# Altium schematic sheet control.SchDoc
size A3
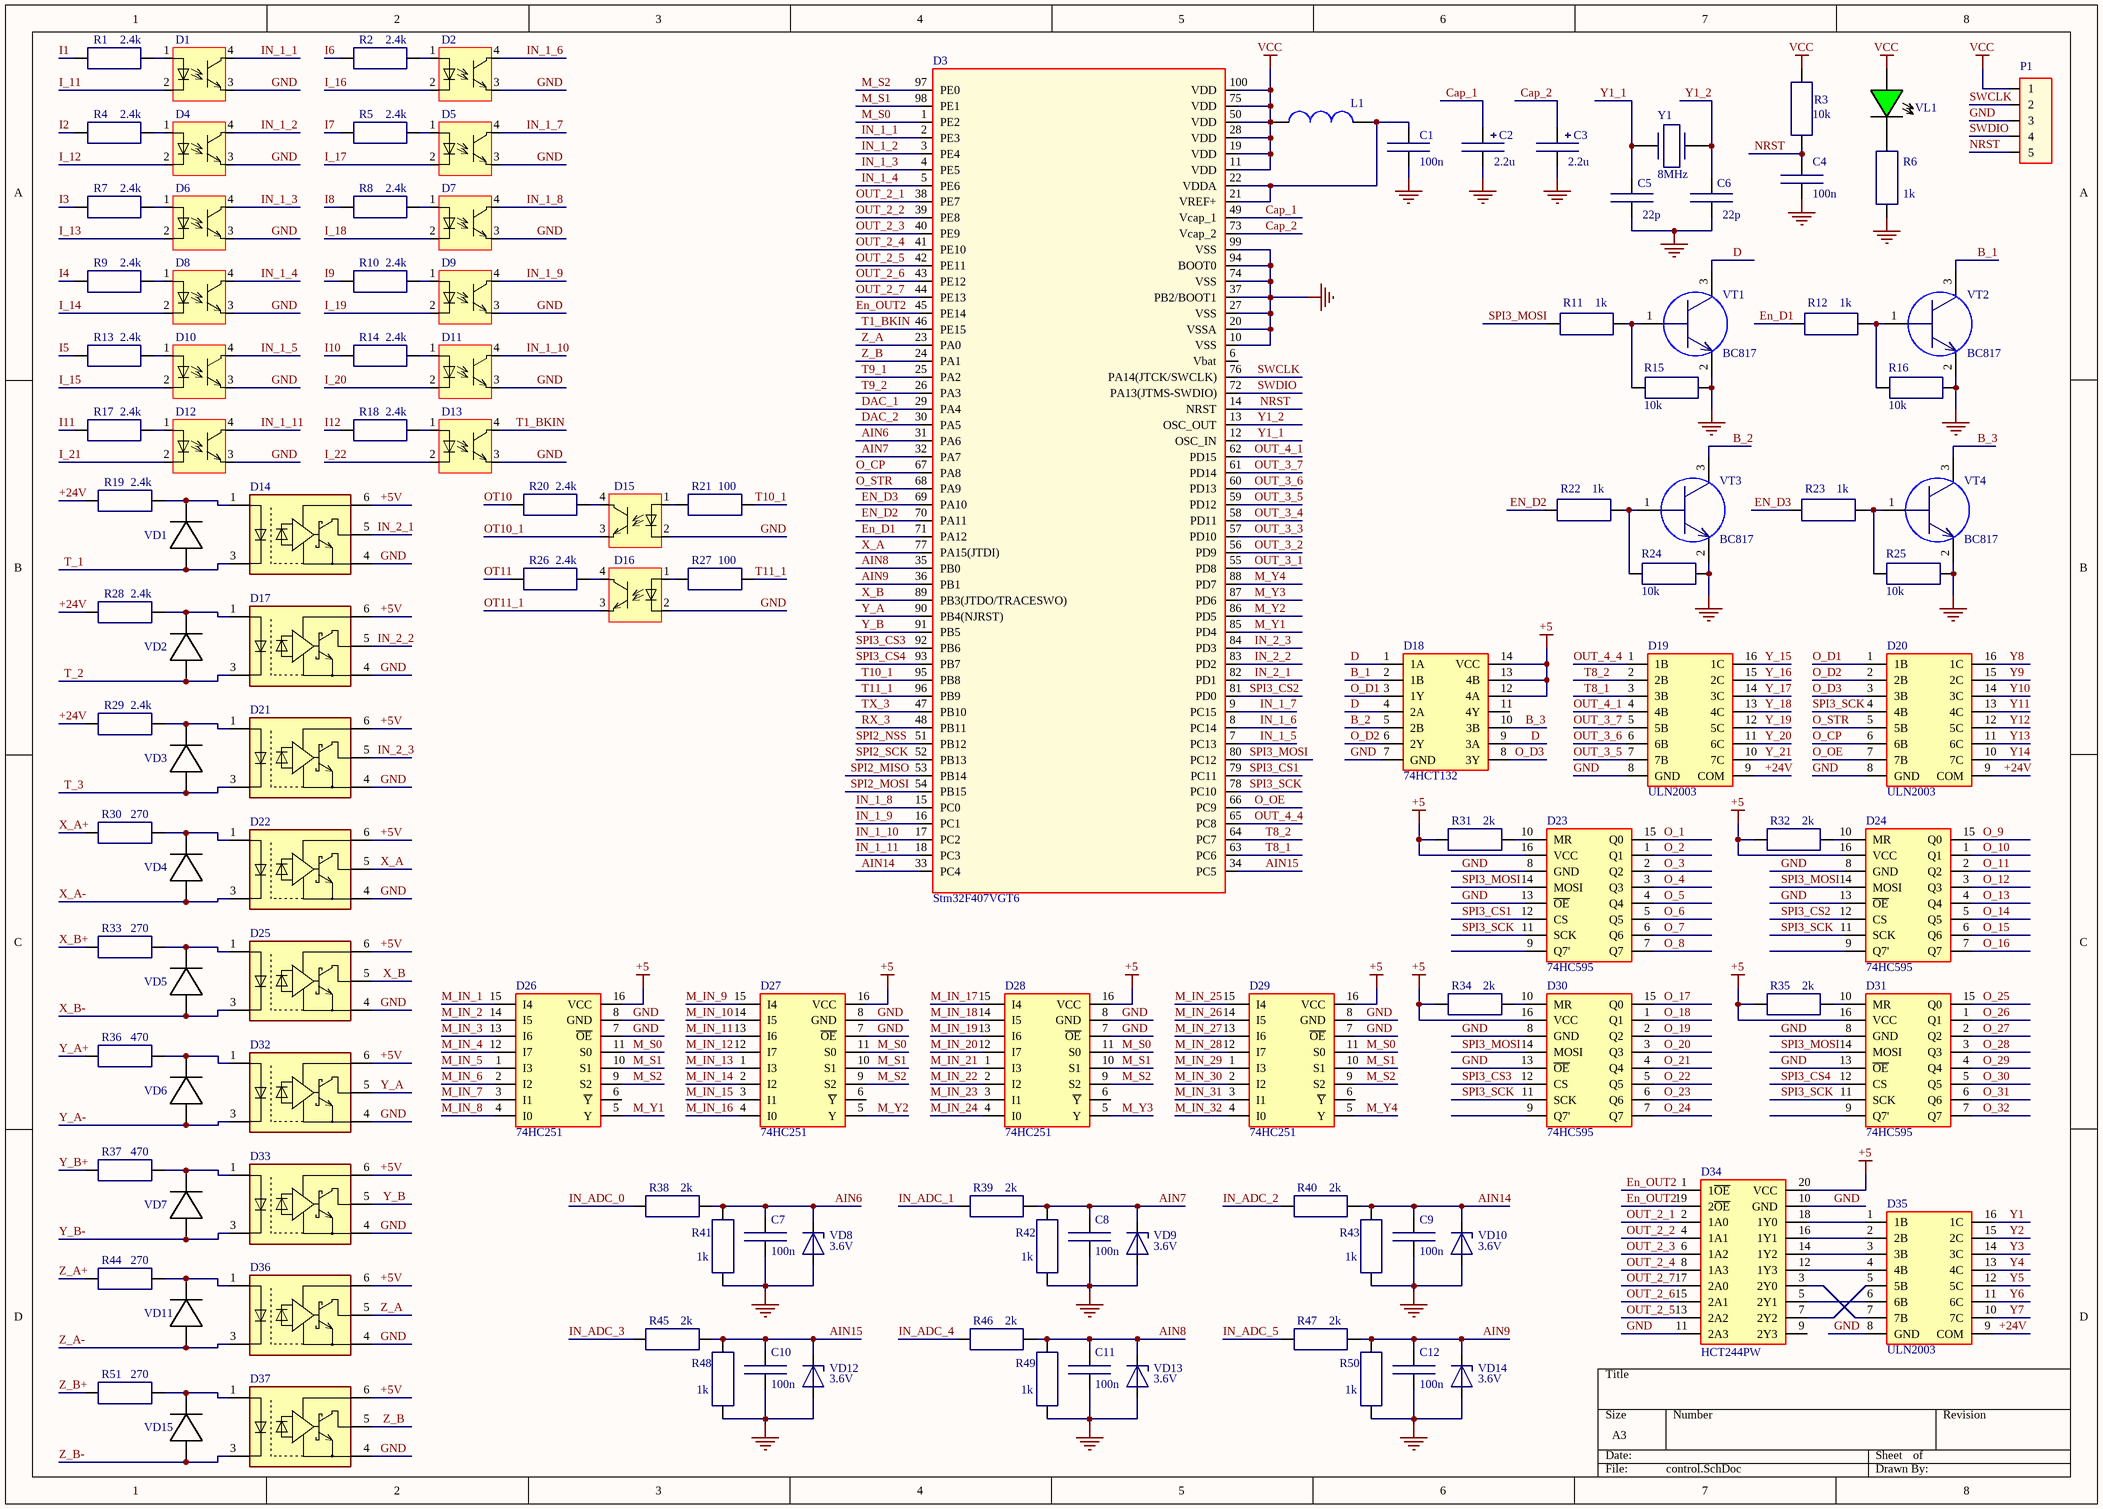
[diagram p0: control.SchDoc]

## Parts
C1  100n  [C0805]
C2  2.2u  [R1206]
C3  2.2u  [R1206]
C4  100n  [C0805]
C5  22p  [C0805]
C6  22p  [C0805]
C7  100n  [C0805]
C8  100n  [C0805]
C9  100n  [C0805]
C10  100n  [C0805]
C11  100n  [C0805]
C12  100n  [C0805]
D1  hcpl-181  [SOP4]  (value not drawn)
D2  hcpl-181  [SOP4]  (value not drawn)
D3  Stm32F407VGT6  [LQFP100]
D4  hcpl-181  [SOP4]  (value not drawn)
D5  hcpl-181  [SOP4]  (value not drawn)
D6  hcpl-181  [SOP4]  (value not drawn)
D7  hcpl-181  [SOP4]  (value not drawn)
D8  hcpl-181  [SOP4]  (value not drawn)
D9  hcpl-181  [SOP4]  (value not drawn)
D10  hcpl-181  [SOP4]  (value not drawn)
D11  hcpl-181  [SOP4]  (value not drawn)
D12  hcpl-181  [SOP4]  (value not drawn)
D13  hcpl-181  [SOP4]  (value not drawn)
D14  LTV-601  [SOP5]  (value not drawn)
D15  hcpl-181  [SOP4]  (value not drawn)
D16  hcpl-181  [SOP4]  (value not drawn)
D17  LTV-601  [SOP5]  (value not drawn)
D18  74HCT132  [SO-14]
D19  ULN2003  [SOIC-16]
D20  ULN2003  [SOIC-16]
D21  LTV-601  [SOP5]  (value not drawn)
D22  LTV-601  [SOP5]  (value not drawn)
D23  74HC595  [SOP16_595]
D24  74HC595  [SOP16_595]
D25  LTV-601  [SOP5]  (value not drawn)
D26  74HC251  [SOP16_595]
D27  74HC251  [SOP16_595]
D28  74HC251  [SOP16_595]
D29  74HC251  [SOP16_595]
D30  74HC595  [SOP16_595]
D31  74HC595  [SOP16_595]
D32  LTV-601  [SOP5]  (value not drawn)
D33  LTV-601  [SOP5]  (value not drawn)
D34  HCT244PW  [TSSOP20]
D35  ULN2003  [SOIC-16]
D36  LTV-601  [SOP5]  (value not drawn)
D37  LTV-601  [SOP5]  (value not drawn)
L1  L  [L]  (value not drawn)
P1  Con_5  [Con_5]  (value not drawn)
R1  2.4k  [R1206]
R2  2.4k  [R1206]
R3  10k  [R0805]
R4  2.4k  [R1206]
R5  2.4k  [R1206]
R6  1k  [R0805]
R7  2.4k  [R1206]
R8  2.4k  [R1206]
R9  2.4k  [R1206]
R10  2.4k  [R1206]
R11  1k  [R0805]
R12  1k  [R0805]
R13  2.4k  [R1206]
R14  2.4k  [R1206]
R15  10k  [R0805]
R16  10k  [R0805]
R17  2.4k  [R1206]
R18  2.4k  [R1206]
R19  2.4k  [R1206]
R20  2.4k  [R1206]
R21  100  [R0805]
R22  1k  [R0805]
R23  1k  [R0805]
R24  10k  [R0805]
R25  10k  [R0805]
R26  2.4k  [R1206]
R27  100  [R0805]
R28  2.4k  [R1206]
R29  2.4k  [R1206]
R30  270  [R0805]
R31  2k  [R0805]
R32  2k  [R0805]
R33  270  [R0805]
R34  2k  [R0805]
R35  2k  [R0805]
R36  470  [R0805]
R37  470  [R0805]
R38  2k  [R0805]
R39  2k  [R0805]
R40  2k  [R0805]
R41  1k  [R0805]
R42  1k  [R0805]
R43  1k  [R0805]
R44  270  [R0805]
R45  2k  [R0805]
R46  2k  [R0805]
R47  2k  [R0805]
R48  1k  [R0805]
R49  1k  [R0805]
R50  1k  [R0805]
R51  270  [R0805]
VD1  LL4448  [R1206]  (value not drawn)
VD2  LL4448  [R1206]  (value not drawn)
VD3  LL4448  [R1206]  (value not drawn)
VD4  LL4448  [R1206]  (value not drawn)
VD5  LL4448  [R1206]  (value not drawn)
VD6  LL4448  [R1206]  (value not drawn)
VD7  LL4448  [R1206]  (value not drawn)
VD8  3.6V  [R1206]
VD9  3.6V  [R1206]
VD10  3.6V  [R1206]
VD11  LL4448  [R1206]  (value not drawn)
VD12  3.6V  [R1206]
VD13  3.6V  [R1206]
VD14  3.6V  [R1206]
VD15  LL4448  [R1206]  (value not drawn)
VL1  LED_1206  [R1206]  (value not drawn)
VT1  BC817  [SOT-23]
VT2  BC817  [SOT-23]
VT3  BC817  [SOT-23]
VT4  BC817  [SOT-23]
Y1  8MHz  [Crystal]

## Nets
+5: D18.12(4A) D18.13(4B) D18.14(VCC) D23.16(VCC) D24.16(VCC) D26.16(VCC) D27.16(VCC) D28.16(VCC) D29.16(VCC) D30.16(VCC) D31.16(VCC) D34.20(VCC) R31.2 R32.2 R34.2 R35.2
GND: C1.2 C2.2 C3.2 C4.1 C5.2 C6.2 C7.2 C8.2 C9.2 C10.2 C11.2 C12.2 D1.3 D2.3 D3.10(VSS) D3.20(VSSA) D3.27(VSS) D3.37(PB2/BOOT1) D3.74(VSS) D3.94(BOOT0) D3.99(VSS) D4.3 D5.3 D6.3 D7.3 D8.3 D9.3 D10.3 D11.3 D12.3 D13.3 D14.4 D15.2 D16.2 D17.4 D18.7(GND) D19.8(GND) D20.8(GND) D21.4 D22.4 D23.8(GND) D23.13(~{OE}) D24.8(GND) D24.13(~{OE}) D25.4 D26.7(~{OE}) D26.8(GND) D27.7(~{OE}) D27.8(GND) D28.7(~{OE}) D28.8(GND) D29.7(~{OE}) D29.8(GND) D30.8(GND) D30.13(~{OE}) D31.8(GND) D31.13(~{OE}) D32.4 D33.4 D34.10(GND) D34.11(2A3) D35.8(GND) D36.4 D37.4 P1.3 R6.1 R15.1 R16.1 R24.1 R25.1 R41.1 R42.1 R43.1 R48.1 R49.1 R50.1 VD8.1 VD9.1 VD10.1 VD12.1 VD13.1 VD14.1 VT1.2 VT2.2 VT3.2 VT4.2
VCC: D3.11(VDD) D3.19(VDD) D3.28(VDD) D3.50(VDD) D3.75(VDD) D3.100(VDD) L1.1 P1.1 R3.1 VL1.1
+5V: D14.6 D17.6 D21.6 D22.6 D25.6 D32.6 D33.6 D36.6 D37.6
+24V: D19.9(COM) D20.9(COM) D35.9(COM) R19.1 R28.1 R29.1
AIN6: C7.1 D3.31(PA6) R38.2 R41.2 VD8.2
AIN7: C8.1 D3.32(PA7) R39.2 R42.2 VD9.2
AIN8: C11.1 D3.35(PB0) R46.2 R49.2 VD13.2
AIN9: C12.1 D3.36(PB1) R47.2 R50.2 VD14.2
AIN14: C9.1 D3.33(PC4) R40.2 R43.2 VD10.2
AIN15: C10.1 D3.34(PC5) R45.2 R48.2 VD12.2
B_1: D18.2(1B) VT2.3
B_2: D18.5(2B) VT3.3
B_3: D18.10(3B) VT4.3
Cap_1: C2.1 D3.49(Vcap_1)
Cap_2: C3.1 D3.73(Vcap_2)
D: D18.1(1A) D18.4(2A) D18.9(3A) VT1.3
DAC_1: D3.29(PA4)
DAC_2: D3.30(PA5)
En_D1: D3.71(PA12) R12.1
EN_D2: D3.70(PA11) R22.1
EN_D3: D3.69(PA10) R23.1
En_OUT2: D3.45(PE14) D34.1(1~{OE}) D34.19(2~{OE})
I1: R1.1
I2: R4.1
I3: R7.1
I4: R9.1
I5: R13.1
I6: R2.1
I7: R5.1
I8: R8.1
I9: R10.1
I10: R14.1
I11: R17.1
I12: R18.1
I_11: D1.2
I_12: D4.2
I_13: D6.2
I_14: D8.2
I_15: D10.2
I_16: D2.2
I_17: D5.2
I_18: D7.2
I_19: D9.2
I_20: D11.2
I_21: D12.2
I_22: D13.2
IN_1_1: D1.4 D3.2(PE3)
IN_1_2: D3.3(PE4) D4.4
IN_1_3: D3.4(PE5) D6.4
IN_1_4: D3.5(PE6) D8.4
IN_1_5: D3.7(PC13) D10.4
IN_1_6: D2.4 D3.8(PC14)
IN_1_7: D3.9(PC15) D5.4
IN_1_8: D3.15(PC0) D7.4
IN_1_9: D3.16(PC1) D9.4
IN_1_10: D3.17(PC2) D11.4
IN_1_11: D3.18(PC3) D12.4
IN_2_1: D3.82(PD1) D14.5
IN_2_2: D3.83(PD2) D17.5
IN_2_3: D3.84(PD3) D21.5
IN_ADC_0: R38.1
IN_ADC_1: R39.1
IN_ADC_2: R40.1
IN_ADC_3: R45.1
IN_ADC_4: R46.1
IN_ADC_5: R47.1
M_IN_1: D26.15(I4)
M_IN_2: D26.14(I5)
M_IN_3: D26.13(I6)
M_IN_4: D26.12(I7)
M_IN_5: D26.1(I3)
M_IN_6: D26.2(I2)
M_IN_7: D26.3(I1)
M_IN_8: D26.4(I0)
M_IN_9: D27.15(I4)
M_IN_10: D27.14(I5)
M_IN_11: D27.13(I6)
M_IN_12: D27.12(I7)
M_IN_13: D27.1(I3)
M_IN_14: D27.2(I2)
M_IN_15: D27.3(I1)
M_IN_16: D27.4(I0)
M_IN_17: D28.15(I4)
M_IN_18: D28.14(I5)
M_IN_19: D28.13(I6)
M_IN_20: D28.12(I7)
M_IN_21: D28.1(I3)
M_IN_22: D28.2(I2)
M_IN_23: D28.3(I1)
M_IN_24: D28.4(I0)
M_IN_25: D29.15(I4)
M_IN_26: D29.14(I5)
M_IN_27: D29.13(I6)
M_IN_28: D29.12(I7)
M_IN_29: D29.1(I3)
M_IN_30: D29.2(I2)
M_IN_31: D29.3(I1)
M_IN_32: D29.4(I0)
M_S0: D3.1(PE2) D26.11(S0) D27.11(S0) D28.11(S0) D29.11(S0)
M_S1: D3.98(PE1) D26.10(S1) D27.10(S1) D28.10(S1) D29.10(S1)
M_S2: D3.97(PE0) D26.9(S2) D27.9(S2) D28.9(S2) D29.9(S2)
M_Y1: D3.85(PD4) D26.5(Y)
M_Y2: D3.86(PD5) D27.5(Y)
M_Y3: D3.87(PD6) D28.5(Y)
M_Y4: D3.88(PD7) D29.5(Y)
NRST: C4.2 D3.14(NRST) P1.5 R3.2
O_1: D23.15(Q0)
O_2: D23.1(Q1)
O_3: D23.2(Q2)
O_4: D23.3(Q3)
O_5: D23.4(Q4)
O_6: D23.5(Q5)
O_7: D23.6(Q6)
O_8: D23.7(Q7)
O_9: D24.15(Q0)
O_10: D24.1(Q1)
O_11: D24.2(Q2)
O_12: D24.3(Q3)
O_13: D24.4(Q4)
O_14: D24.5(Q5)
O_15: D24.6(Q6)
O_16: D24.7(Q7)
O_17: D30.15(Q0)
O_18: D30.1(Q1)
O_19: D30.2(Q2)
O_20: D30.3(Q3)
O_21: D30.4(Q4)
O_22: D30.5(Q5)
O_23: D30.6(Q6)
O_24: D30.7(Q7)
O_25: D31.15(Q0)
O_26: D31.1(Q1)
O_27: D31.2(Q2)
O_28: D31.3(Q3)
O_29: D31.4(Q4)
O_30: D31.5(Q5)
O_31: D31.6(Q6)
O_32: D31.7(Q7)
O_CP: D3.67(PA8) D20.6(6B)
O_D1: D18.3(1Y) D20.1(1B)
O_D2: D18.6(2Y) D20.2(2B)
O_D3: D18.8(3Y) D20.3(3B)
O_OE: D3.66(PC9) D20.7(7B)
O_STR: D3.68(PA9) D20.5(5B)
OT10: R20.1
OT10_1: D15.3
OT11: R26.1
OT11_1: D16.3
OUT_2_1: D3.38(PE7) D34.2(1A0)
OUT_2_2: D3.39(PE8) D34.4(1A1)
OUT_2_3: D3.40(PE9) D34.6(1A2)
OUT_2_4: D3.41(PE10) D34.8(1A3)
OUT_2_5: D3.42(PE11) D34.13(2A2)
OUT_2_6: D3.43(PE12) D34.15(2A1)
OUT_2_7: D3.44(PE13) D34.17(2A0)
OUT_3_1: D3.55(PD8)
OUT_3_2: D3.56(PD9)
OUT_3_3: D3.57(PD10)
OUT_3_4: D3.58(PD11)
OUT_3_5: D3.59(PD12) D19.7(7B)
OUT_3_6: D3.60(PD13) D19.6(6B)
OUT_3_7: D3.61(PD14) D19.5(5B)
OUT_4_1: D3.62(PD15) D19.4(4B)
OUT_4_4: D3.65(PC8) D19.1(1B)
RX_3: D3.48(PB11)
SPI2_MISO: D3.53(PB14)
SPI2_MOSI: D3.54(PB15)
SPI2_NSS: D3.51(PB12)
SPI2_SCK: D3.52(PB13)
SPI3_CS1: D3.79(PC11) D23.12(CS)
SPI3_CS2: D3.81(PD0) D24.12(CS)
SPI3_CS3: D3.92(PB6) D30.12(CS)
SPI3_CS4: D3.93(PB7) D31.12(CS)
SPI3_MOSI: D3.80(PC12) D23.14(MOSI) D24.14(MOSI) D30.14(MOSI) D31.14(MOSI) R11.1
SPI3_SCK: D3.78(PC10) D20.4(4B) D23.11(SCK) D24.11(SCK) D30.11(SCK) D31.11(SCK)
SWCLK: D3.76(PA14(JTCK/SWCLK)) P1.2
SWDIO: D3.72(PA13(JTMS-SWDIO)) P1.4
T1_BKIN: D3.46(PE15) D13.4
T8_1: D3.63(PC6) D19.3(3B)
T8_2: D3.64(PC7) D19.2(2B)
T9_1: D3.25(PA2)
T9_2: D3.26(PA3)
T10_1: D3.95(PB8) R21.2
T11_1: D3.96(PB9) R27.2
T_1: D14.3 VD1.1
T_2: D17.3 VD2.1
T_3: D21.3 VD3.1
TX_3: D3.47(PB10)
X_A: D3.77(PA15(JTDI)) D22.5
X_A+: R30.1
X_A-: D22.3 VD4.1
X_B: D3.89(PB3(JTDO/TRACESWO)) D25.5
X_B+: R33.1
X_B-: D25.3 VD5.1
Y1: D35.16(1C)
Y1_1: C5.1 D3.12(OSC_IN) Y1.2
Y1_2: C6.1 D3.13(OSC_OUT) Y1.1
Y2: D35.15(2C)
Y3: D35.14(3C)
Y4: D35.13(4C)
Y5: D35.12(5C)
Y6: D35.11(6C)
Y7: D35.10(7C)
Y8: D20.16(1C)
Y9: D20.15(2C)
Y10: D20.14(3C)
Y11: D20.13(4C)
Y12: D20.12(5C)
Y13: D20.11(6C)
Y14: D20.10(7C)
Y_15: D19.16(1C)
Y_16: D19.15(2C)
Y_17: D19.14(3C)
Y_18: D19.13(4C)
Y_19: D19.12(5C)
Y_20: D19.11(6C)
Y_21: D19.10(7C)
Y_A: D3.90(PB4(NJRST)) D32.5
Y_A+: R36.1
Y_A-: D32.3 VD6.1
Y_B: D3.91(PB5) D33.5
Y_B+: R37.1
Y_B-: D33.3 VD7.1
Z_A: D3.23(PA0) D36.5
Z_A+: R44.1
Z_A-: D36.3 VD11.1
Z_B: D3.24(PA1) D37.5
Z_B+: R51.1
Z_B-: D37.3 VD15.1
NetC1_1: C1.1 D3.21(VREF+) D3.22(VDDA) L1.2
NetD1_1: D1.1 R1.2
NetD2_1: D2.1 R2.2
NetD4_1: D4.1 R4.2
NetD5_1: D5.1 R5.2
NetD6_1: D6.1 R7.2
NetD7_1: D7.1 R8.2
NetD8_1: D8.1 R9.2
NetD9_1: D9.1 R10.2
NetD10_1: D10.1 R13.2
NetD11_1: D11.1 R14.2
NetD12_1: D12.1 R17.2
NetD13_1: D13.1 R18.2
NetD14_1: D14.1 R19.2 VD1.2
NetD15_1: D15.1 R21.1
NetD15_4: D15.4 R20.2
NetD16_1: D16.1 R27.1
NetD16_4: D16.4 R26.2
NetD17_1: D17.1 R28.2 VD2.2
NetD21_1: D21.1 R29.2 VD3.2
NetD22_1: D22.1 R30.2 VD4.2
NetD23_10: D23.10(MR) R31.1
NetD24_10: D24.10(MR) R32.1
NetD25_1: D25.1 R33.2 VD5.2
NetD30_10: D30.10(MR) R34.1
NetD31_10: D31.10(MR) R35.1
NetD32_1: D32.1 R36.2 VD6.2
NetD33_1: D33.1 R37.2 VD7.2
NetD34_3: D34.3(2Y0) D35.7(7B)
NetD34_5: D34.5(2Y1) D35.6(6B)
NetD34_7: D34.7(2Y2) D35.5(5B)
NetD34_12: D34.12(1Y3) D35.4(4B)
NetD34_14: D34.14(1Y2) D35.3(3B)
NetD34_16: D34.16(1Y1) D35.2(2B)
NetD34_18: D34.18(1Y0) D35.1(1B)
NetD36_1: D36.1 R44.2 VD11.2
NetD37_1: D37.1 R51.2 VD15.2
NetR6_2: R6.2 VL1.2
NetR11_2: R11.2 R15.2 VT1.1
NetR12_2: R12.2 R16.2 VT2.1
NetR22_2: R22.2 R24.2 VT3.1
NetR23_2: R23.2 R25.2 VT4.1

Not connected (* = marked no-connect by the designer): D3 6(Vbat); D18 11(4Y); D23 9(Q7'); D24 9(Q7'); D26 6(~{Y}); D27 6(~{Y}); D28 6(~{Y}); D29 6(~{Y}); D30 9(Q7'); D31 9(Q7'); D34 9(2Y3)

## Library data of the parts
C1 C4-C12 = C0805
C2 C3 = Tantal_2.2
R1 R2 R4 R5 R7-R10 R13 R14 R17-R20 R26 R28 R29 = R1206
R3 R6 R11 R12 R15 R16 R21-R25 R27 R30-R51 = R0805
VD8-VD10 VD12-VD14 = Zener
VT1-VT4 = NPN
Y1 = Crystal